# Altium schematic sheet DisplaySheet.SchDoc
size A4; SheetNumber: 1; SheetTotal: 3
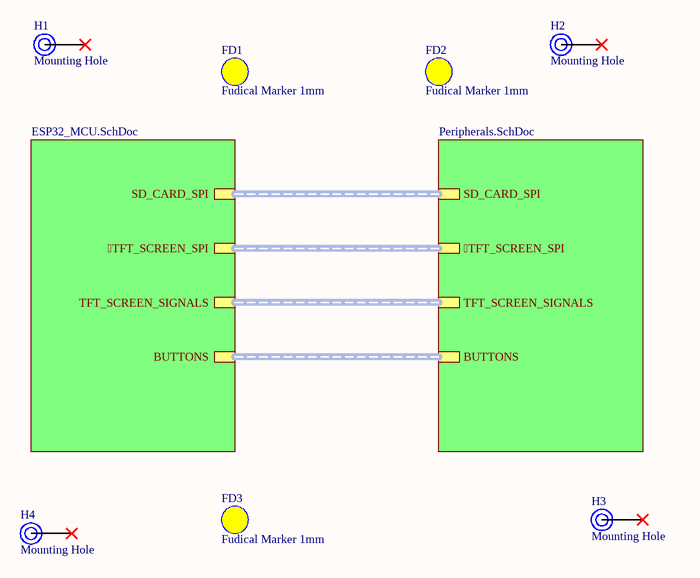
[diagram p0: DisplaySheet.SchDoc]

## Parts
FD1  Fudical Marker 1mm  [FIDUCIAL-1MM]
FD2  Fudical Marker 1mm  [FIDUCIAL-1MM]
FD3  Fudical Marker 1mm  [FIDUCIAL-1MM]
H1  Mounting Hole  [Mounting Holes-Footprint-1]
H2  Mounting Hole  [Mounting Holes-Footprint-1]
H3  Mounting Hole  [Mounting Holes-Footprint-1]
H4  Mounting Hole  [Mounting Holes-Footprint-1]

## Sub-sheets
U_ESP32_MCU = ESP32_MCU.SchDoc: SD_CARD_SPI (harness SD_CARD_SPI), TFT_SCREEN_SPI (harness TFT_SCREEN_SPI), TFT_SCREEN_SIGNALS (harness TFT_SCREEN_SIGNALS), BUTTONS (harness BUTTONS)
U_Peripherals = Peripherals.SchDoc: SD_CARD_SPI (harness SD_CARD_SPI), TFT_SCREEN_SPI (harness TFT_SCREEN_SPI), TFT_SCREEN_SIGNALS (harness TFT_SCREEN_SIGNALS), BUTTONS (harness BUTTONS)

## Nets

Not connected (* = marked no-connect by the designer): H1 0*; H2 0*; H3 0*; H4 0*

## Buses and harness runs
harness sheet U_ESP32_MCU/TFT_SCREEN_SPI = sheet U_Peripherals/TFT_SCREEN_SPI
harness sheet U_ESP32_MCU/BUTTONS = sheet U_Peripherals/BUTTONS
harness sheet U_ESP32_MCU/SD_CARD_SPI = sheet U_Peripherals/SD_CARD_SPI
harness sheet U_ESP32_MCU/TFT_SCREEN_SIGNALS = sheet U_Peripherals/TFT_SCREEN_SIGNALS

## Library data of the parts
FD1-FD3 = FD
H1-H4 = CMP-108-0002-3: Mechanical mounting hole for vertical stack